# Altium project Power-Controller_mcu增高基板.PrjPcb
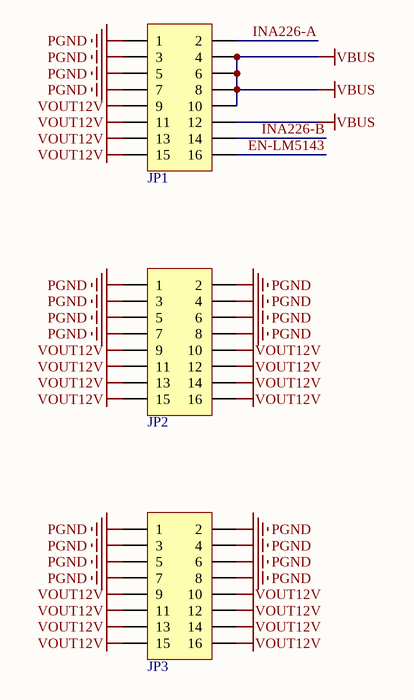
[diagram p0: Connector.SchDoc]
1 sheet, 3 parts. Net scope: global (net labels, ports and power ports of the same name join across sheets).
Board file: mcu增高基板.PcbDoc

## Sheet Connector.SchDoc
size A4; SheetNumber: 1; SheetTotal: 1

### Parts
JP1  Header 8X2  [HDR2.54-LI-2x8P]  (value not drawn)
JP2  Header 8X2  [HDR2.54-LI-2x8P]  (value not drawn)
JP3  Header 8X2  [HDR2.54-LI-2x8P]  (value not drawn)

### Nets
PGND: JP1.1 JP1.3 JP1.5 JP1.7 JP2.1 JP2.2 JP2.3 JP2.4 JP2.5 JP2.6 JP2.7 JP2.8 JP3.1 JP3.2 JP3.3 JP3.4 JP3.5 JP3.6 JP3.7 JP3.8
VBUS: JP1.4 JP1.6 JP1.8 JP1.10 JP1.12
VOUT12V: JP1.9 JP1.11 JP1.13 JP1.15 JP2.9 JP2.10 JP2.11 JP2.12 JP2.13 JP2.14 JP2.15 JP2.16 JP3.9 JP3.10 JP3.11 JP3.12 JP3.13 JP3.14 JP3.15 JP3.16
EN-LM5143: JP1.16
INA226-A: JP1.2
INA226-B: JP1.14

### Library data of the parts
JP1-JP3 = Header 8X2: 8*2P接插件; 版权归属: 源创客; BOM名称: 8*2P接插件; 学习资源: www.ooocke.com